# Altium schematic sheet Sheet1.SchDoc
size A
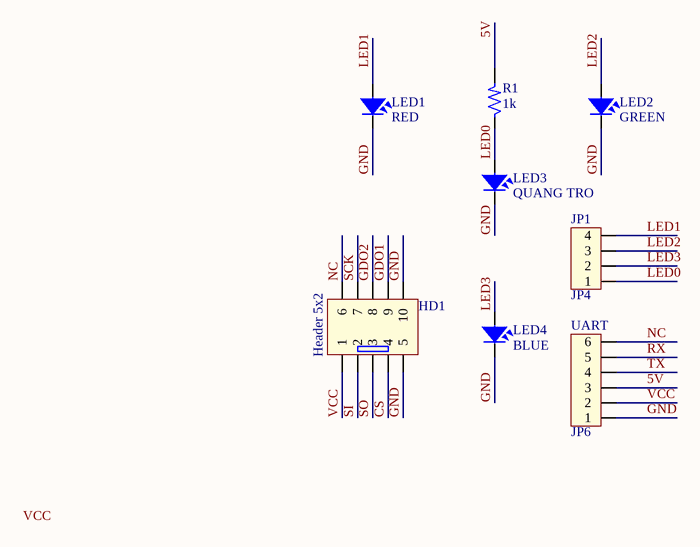
[diagram p0: Sheet1.SchDoc]

## Parts
HD1  Header 5x2  [HED2X5_cen]
JP1  JP4  [CON4]
LED1  RED  [LED_5mm]
LED2  GREEN  [LED_5mm]
LED3  QUANG TRO  [LED_5mm]
LED4  BLUE  [LED_5mm]
R1  1k  [R1/2W]
UART  JP6  [CON6]

## Nets
5V: R1.2 UART.3
CS: HD1.4
GDO1: HD1.9
GDO2: HD1.8
GND: HD1.5 HD1.10 LED1.2 LED2.2 LED3.2 LED4.2 UART.1
LED0: JP1.1 LED3.1 R1.1
LED1: JP1.4 LED1.1
LED2: JP1.3 LED2.1
LED3: JP1.2 LED4.1
NC: HD1.6 UART.6
RX: UART.5
SCK: HD1.7
SI: HD1.2
SO: HD1.3
TX: UART.4
VCC: HD1.1 UART.2

## Notes on the sheet
- Labels drawn without touching a wire or pin: VCC

## Library data of the parts
HD1 = HED5x2: Value: Header 5x2
JP1 = Con4: Connector 4; Value: Connector 4
LED1-LED4 = LED: LED Single colour Green and Red; Value: LED 3 ly Single Colour
R1 = R: Resistor 1/4W; Value: R1/4W - 1K
UART = Con6: Connector 6; Value: Connector 6